# EAGLE design Kiwi_Rev_3.1S (EAGLE 9.1.0)
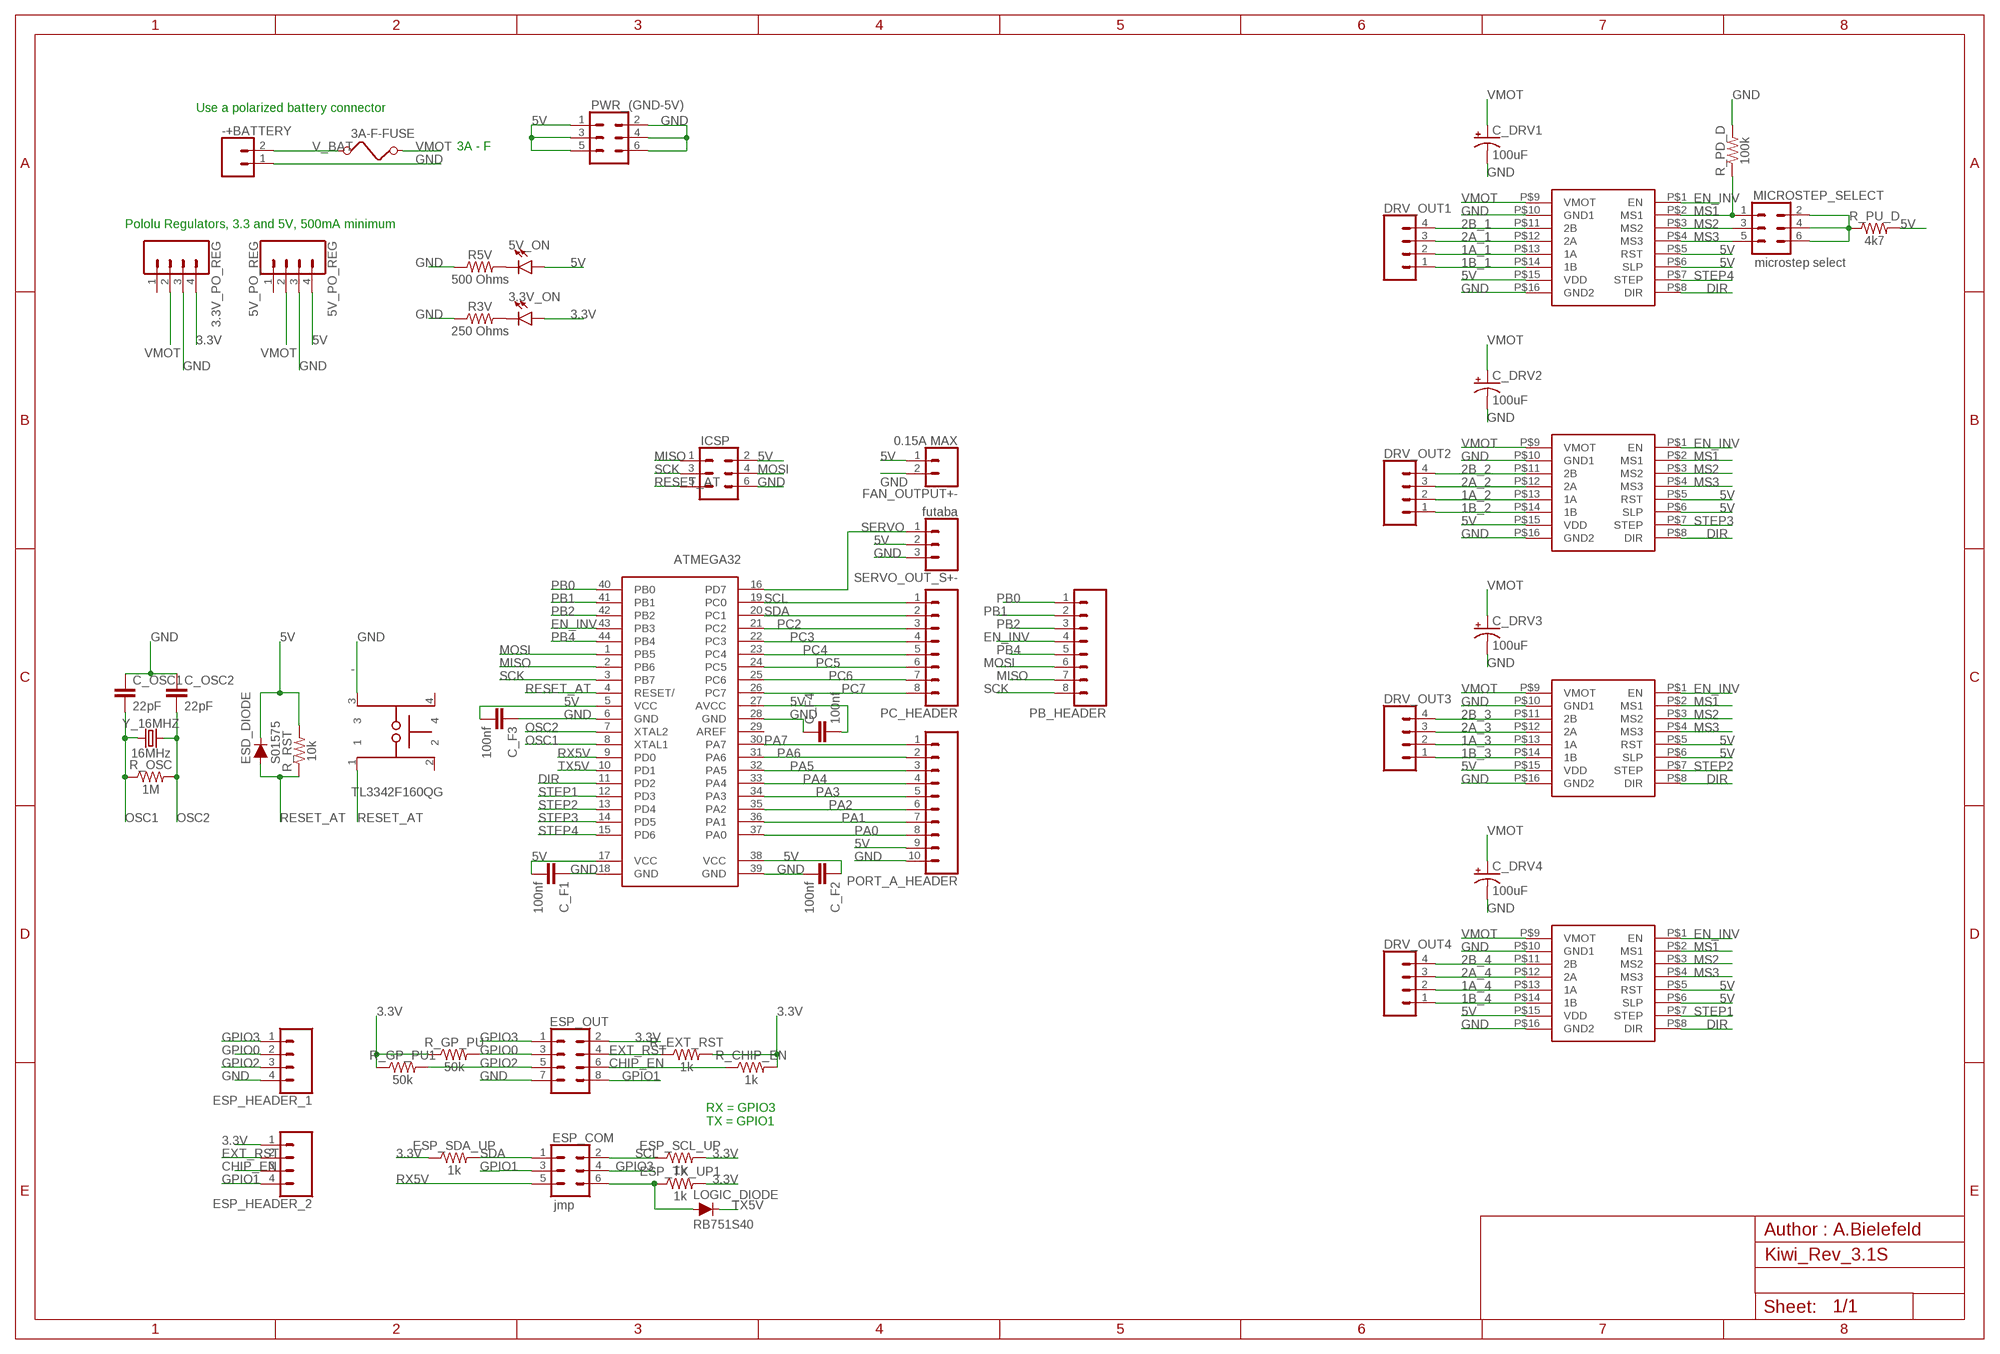
[diagram p0: schematic, sheet 1]

## Parts
3.3V_ON  LED1206  [LED-1206]
3.3V_PO_REG  CONN_04  [1X04]
3A-F-FUSE  FUSE  [FUSE]
5V_ON  LED1206  [LED-1206]
5V_PO_REG  5V_PO_REG  CONN_04  [1X04]
-  TL3342F160QG  [SW_TL3342F160QG]
-+BATTERY  CONN_023.5MM  [SCREWTERMINAL-3.5MM-2]
ATMEGA32  ATMEGA32  [QFP80P1200X1200X120-44N]
C_DRV1  100uF  100UF-POLAR-RADIAL-2.5MM-25V-20%  [CPOL-RADIAL-2.5MM-6.5MM]
C_DRV2  100uF  100UF-POLAR-RADIAL-2.5MM-25V-20%  [CPOL-RADIAL-2.5MM-6.5MM]
C_DRV3  100uF  100UF-POLAR-RADIAL-2.5MM-25V-20%  [CPOL-RADIAL-2.5MM-6.5MM]
C_DRV4  100uF  100UF-POLAR-RADIAL-2.5MM-25V-20%  [CPOL-RADIAL-2.5MM-6.5MM]
C_F1  100nf  2.2UF-0603-10V-20%  [0603]
C_F2  100nf  2.2UF-0603-10V-20%  [0603]
C_F3  100nf  2.2UF-0603-10V-20%  [0603]
C_F4  100nf  2.2UF-0603-10V-20%  [0603]
C_OSC1  22pF  2.2UF-1206-50V-10%  [1206]
C_OSC2  22pF  2.2UF-1206-50V-10%  [1206]
DRIVER1  POLOLU_A4988  [POLOLU_CARRIER]
DRIVER2  POLOLU_A4988  [POLOLU_CARRIER]
DRIVER3  POLOLU_A4988  [POLOLU_CARRIER]
DRIVER4  POLOLU_A4988  [POLOLU_CARRIER]
DRV_OUT1  CONN_04  [1X04]
DRV_OUT2  CONN_04  [1X04]
DRV_OUT3  CONN_04  [1X04]
DRV_OUT4  CONN_04  [1X04]
ESD_DIODE  S01575  [1206]
ESP_COM  jmp  CONN_03X2FEMALE  [2X3]
ESP_HEADER_1  CONN_04  [1X04]
ESP_HEADER_2  CONN_04  [1X04]
ESP_OUT  CONN_04X2  [2X4]
ESP_SCL_UP  1k  10OHM-1206-1/4W-1%  [1206]
ESP_SDA_UP  1k  10OHM-1206-1/4W-1%  [1206]
ESP_TX_UP1  1k  10OHM-1206-1/4W-1%  [1206]
FAN_OUTPUT+-  0.15A MAX  CONN_02  [1X02]
ICSP  CONN_03X22X3_SILK_MALE_PTH  [2X3]
LOGIC_DIODE  RB751S40  [SOD523]
MICROSTEP_SELECT  microstep select  CONN_03X2FEMALE  [2X3]
PB_HEADER  CONN_08"  [1X08]
PC_HEADER  CONN_08"  [1X08]
PORT_A_HEADER  CONN_10"  [1X10]
PWR_(GND-5V)  CONN_03X22X3_SILK_MALE_PTH  [2X3]
R3V  250 Ohms  10OHM-1206-1/4W-1%  [1206]
R5V  500 Ohms  10OHM-1206-1/4W-1%  [1206]
R_CHIP_EN  1k  10OHM-1206-1/4W-1%  [1206]
R_EXT_RST  1k  10OHM-1206-1/4W-1%  [1206]
R_GP_PU  50k  10OHM-1206-1/4W-1%  [1206]
R_GP_PU1  50k  10OHM-1206-1/4W-1%  [1206]
R_OSC  1M  10OHM-1206-1/4W-1%  [1206]
R_PD_D  100k  10OHM-1206-1/4W-1%  [1206]
R_PU_D  4k7  10OHM-1206-1/4W-1%  [1206]
R_RST  10k  10OHM-1206-1/4W-1%  [1206]
SERVO_OUT_S+-  futaba  CONN_03  [1X03]
Y_16MHZ  16MHz  CRYSTAL-16MHZPTH-HC49US  [HC49US]

## Nets
1A_1: DRIVER1.P$13(1A) DRV_OUT1.2
1A_2: DRIVER2.P$13(1A) DRV_OUT2.2
1A_3: DRIVER3.P$13(1A) DRV_OUT3.2
1A_4: DRIVER4.P$13(1A) DRV_OUT4.2
1B_1: DRIVER1.P$14(1B) DRV_OUT1.1
1B_2: DRIVER2.P$14(1B) DRV_OUT2.1
1B_3: DRIVER3.P$14(1B) DRV_OUT3.1
1B_4: DRIVER4.P$14(1B) DRV_OUT4.1
2A_1: DRIVER1.P$12(2A) DRV_OUT1.3
2A_2: DRIVER2.P$12(2A) DRV_OUT2.3
2A_3: DRIVER3.P$12(2A) DRV_OUT3.3
2A_4: DRIVER4.P$12(2A) DRV_OUT4.3
2B_1: DRIVER1.P$11(2B) DRV_OUT1.4
2B_2: DRIVER2.P$11(2B) DRV_OUT2.4
2B_3: DRIVER3.P$11(2B) DRV_OUT3.4
2B_4: DRIVER4.P$11(2B) DRV_OUT4.4
3.3V: 3.3V_ON.A 3.3V_PO_REG.4 ESP_HEADER_2.1 ESP_OUT.2 ESP_SCL_UP.2 ESP_SDA_UP.1 ESP_TX_UP1.2 R_CHIP_EN.2 R_EXT_RST.2 R_GP_PU1.1 R_GP_PU.1
5V: 5V_ON.A 5V_PO_REG.4 ATMEGA32.5(VCC) ATMEGA32.17(VCC) ATMEGA32.27(AVCC) ATMEGA32.38(VCC) C_F1.2 C_F2.1 C_F3.2 C_F4.2 DRIVER1.P$5(RST) DRIVER1.P$6(SLP) DRIVER1.P$15(VDD) DRIVER2.P$5(RST) DRIVER2.P$6(SLP) DRIVER2.P$15(VDD) DRIVER3.P$5(RST) DRIVER3.P$6(SLP) DRIVER3.P$15(VDD) DRIVER4.P$5(RST) DRIVER4.P$6(SLP) DRIVER4.P$15(VDD) ESD_DIODE.2(C) FAN_OUTPUT+-.1 ICSP.2 PORT_A_HEADER.9 PWR_(GND-5V).1 PWR_(GND-5V).3 PWR_(GND-5V).5 R_PU_D.2 R_RST.2 SERVO_OUT_S+-.2
CHIP_EN: ESP_HEADER_2.3 ESP_OUT.6 R_CHIP_EN.1
DIR: ATMEGA32.11(PD2) DRIVER1.P$8(DIR) DRIVER2.P$8(DIR) DRIVER3.P$8(DIR) DRIVER4.P$8(DIR)
EN_INV: ATMEGA32.43(PB3) DRIVER1.P$1(EN) DRIVER2.P$1(EN) DRIVER3.P$1(EN) DRIVER4.P$1(EN) PB_HEADER.4
EXT_RST: ESP_HEADER_2.2 ESP_OUT.4 R_EXT_RST.1
GND: 3.3V_PO_REG.3 5V_PO_REG.3 -+BATTERY.1 -.3 ATMEGA32.6(GND) ATMEGA32.18(GND) ATMEGA32.28(GND) ATMEGA32.39(GND) C_DRV1.2(-) C_DRV2.2(-) C_DRV3.2(-) C_DRV4.2(-) C_F1.1 C_F2.2 C_F3.1 C_F4.1 C_OSC1.1 C_OSC2.1 DRIVER1.P$10(GND1) DRIVER1.P$16(GND2) DRIVER2.P$10(GND1) DRIVER2.P$16(GND2) DRIVER3.P$10(GND1) DRIVER3.P$16(GND2) DRIVER4.P$10(GND1) DRIVER4.P$16(GND2) ESP_HEADER_1.4 ESP_OUT.7 FAN_OUTPUT+-.2 ICSP.6 PORT_A_HEADER.10 PWR_(GND-5V).2 PWR_(GND-5V).4 PWR_(GND-5V).6 R3V.1 R5V.1 R_PD_D.2 SERVO_OUT_S+-.3
GPIO0: ESP_HEADER_1.2 ESP_OUT.3 R_GP_PU.2
GPIO1: ESP_COM.3 ESP_HEADER_2.4 ESP_OUT.8
GPIO2: ESP_HEADER_1.3 ESP_OUT.5 R_GP_PU1.2
GPIO3: ESP_COM.4 ESP_HEADER_1.1 ESP_OUT.1
MISO: ATMEGA32.2(PB6) ICSP.1 PB_HEADER.7
MOSI: ATMEGA32.1(PB5) ICSP.4 PB_HEADER.6
MS1: DRIVER1.P$2(MS1) DRIVER2.P$2(MS1) DRIVER3.P$2(MS1) DRIVER4.P$2(MS1) MICROSTEP_SELECT.1 R_PD_D.1
MS2: DRIVER1.P$3(MS2) DRIVER2.P$3(MS2) DRIVER3.P$3(MS2) DRIVER4.P$3(MS2) MICROSTEP_SELECT.3
MS3: DRIVER1.P$4(MS3) DRIVER2.P$4(MS3) DRIVER3.P$4(MS3) DRIVER4.P$4(MS3) MICROSTEP_SELECT.5
N$1: 3.3V_ON.C R3V.2
N$2: 5V_ON.C R5V.2
N$18: ESP_COM.6 ESP_TX_UP1.1 LOGIC_DIODE.A
NET_PU1: MICROSTEP_SELECT.2 MICROSTEP_SELECT.4 MICROSTEP_SELECT.6 R_PU_D.1
OSC1: ATMEGA32.8(XTAL1) C_OSC1.2 R_OSC.1 Y_16MHZ.1
OSC2: ATMEGA32.7(XTAL2) C_OSC2.2 R_OSC.2 Y_16MHZ.2
PA0: ATMEGA32.37(PA0) PORT_A_HEADER.8
PA1: ATMEGA32.36(PA1) PORT_A_HEADER.7
PA2: ATMEGA32.35(PA2) PORT_A_HEADER.6
PA3: ATMEGA32.34(PA3) PORT_A_HEADER.5
PA4: ATMEGA32.33(PA4) PORT_A_HEADER.4
PA5: ATMEGA32.32(PA5) PORT_A_HEADER.3
PA6: ATMEGA32.31(PA6) PORT_A_HEADER.2
PA7: ATMEGA32.30(PA7) PORT_A_HEADER.1
PB0: ATMEGA32.40(PB0) PB_HEADER.1
PB1: ATMEGA32.41(PB1) PB_HEADER.2
PB2: ATMEGA32.42(PB2) PB_HEADER.3
PB4: ATMEGA32.44(PB4) PB_HEADER.5
PC2: ATMEGA32.21(PC2) PC_HEADER.3
PC3: ATMEGA32.22(PC3) PC_HEADER.4
PC4: ATMEGA32.23(PC4) PC_HEADER.5
PC5: ATMEGA32.24(PC5) PC_HEADER.6
PC6: ATMEGA32.25(PC6) PC_HEADER.7
PC7: ATMEGA32.26(PC7) PC_HEADER.8
RESET_AT: -.1 ATMEGA32.4(RESET/) ESD_DIODE.1(A) ICSP.5 R_RST.1
RX5V: ATMEGA32.9(PD0) ESP_COM.5
SCK: ATMEGA32.3(PB7) ICSP.3 PB_HEADER.8
SCL: ATMEGA32.19(PC0) ESP_COM.2 ESP_SCL_UP.1 PC_HEADER.1
SDA: ATMEGA32.20(PC1) ESP_COM.1 ESP_SDA_UP.2 PC_HEADER.2
SERVO: ATMEGA32.16(PD7) SERVO_OUT_S+-.1
STEP1: ATMEGA32.12(PD3) DRIVER4.P$7(STEP)
STEP2: ATMEGA32.13(PD4) DRIVER3.P$7(STEP)
STEP3: ATMEGA32.14(PD5) DRIVER2.P$7(STEP)
STEP4: ATMEGA32.15(PD6) DRIVER1.P$7(STEP)
TX5V: ATMEGA32.10(PD1) LOGIC_DIODE.C
V_BAT: 3A-F-FUSE.1 -+BATTERY.2
VMOT: 3.3V_PO_REG.2 3A-F-FUSE.2 5V_PO_REG.2 C_DRV1.1(+) C_DRV2.1(+) C_DRV3.1(+) C_DRV4.1(+) DRIVER1.P$9(VMOT) DRIVER2.P$9(VMOT) DRIVER3.P$9(VMOT) DRIVER4.P$9(VMOT)
Unconnected: 3.3V_PO_REG.1 5V_PO_REG.1 -.2 -.4 ATMEGA32.29(AREF)

## Notes on the sheet
- Use a polarized battery connector
- 3A - F
- Pololu Regulators, 3.3 and 5V, 500mA minimum
- RX = GPIO3
  TX = GPIO1
- Author : A.Bielefeld

## Library data of the parts
3.3V_ON 5V_ON = SparkFun-LED:LED: LED (Generic) Standard schematic elements and footprints for 5mm, 3mm, 1206, and 0603 sized LEDs. Generic LEDs with no color specified.
3.3V_PO_REG 5V_PO_REG DRV_OUT1-DRV_OUT4 ESP_HEADER_1 ESP_HEADER_2 = SparkFun-Connectors:CONN_04: Multi connection point. Often used as Generic Header-pin footprint for 0.1 inch spaced/style header connections On any of the 0.1 inch spaced packages, you can populate with these: Break Away Headers - Straight (PRT-00116) Break Away Male Headers - Right Angle (PRT-00553) Female Headers (PRT-00115) Break Away Headers - Machine Pin (PRT-00117) Break Away Female Headers - Swiss Machine Pin (PRT-00743) For SCREWTERMINALS and SPRING TERMINALS visit here: Screw Terimnals on SparkFun.com (5mm/3.5mm/2.54mm spacing) This device is also useful as a general connection point to wire up your design to another part of your project. Our various solder wires solder well into these plated through hole pads. Hook-Up Wire - Assortment (Stranded, 22 AWG) (PRT-11375) Hook-Up Wire - Assortment (Solid Core, 22 AWG) (PRT-11367) View the entire wire category on our website here Special notes: Molex polarized connector foot print use with SKU : PRT-08231 with associated crimp pins and housings. 1MM SMD Version SKU: PRT-10208; PROD_ID: CONN-09696
3A-F-FUSE = special:FUSE: FUSE 5 x 20 mm
- = TL3342F160QG:TL3342F160QG: TL3342 Series SPST 1.6 N Round Button Gull Wing Surface Mount Tactile Switch; AVAILABILITY: Good; DESCRIPTION: TL3342 Series SPST 1.6 N Round Button Gull Wing Surface Mount Tactile Switch; MF: E-Switch; MP: TL3342F160QG; PACKAGE: None; PRICE: 0.41 USD
-+BATTERY = SparkFun-Connectors:CONN_02: Multi connection point. Often used as Generic Header-pin footprint for 0.1 inch spaced/style header connections On any of the 0.1 inch spaced packages, you can populate with these: Break Away Headers - Straight (PRT-00116) Break Away Male Headers - Right Angle (PRT-00553) Female Headers (PRT-00115) Break Away Headers - Machine Pin (PRT-00117) Break Away Female Headers - Swiss Machine Pin (PRT-00743) For SCREWTERMINALS and SPRING TERMINALS visit here: Screw Terimnals on SparkFun.com (5mm/3.5mm/2.54mm spacing) This device is also useful as a general connection point to wire up your design to another part of your project. Our various solder wires solder well into these plated through hole pads. Hook-Up Wire - Assortment (Stranded, 22 AWG) (PRT-11375) Hook-Up Wire - Assortment (Solid Core, 22 AWG) (PRT-11367) View the entire wire category on our website here Special notes: Molex polarized connector foot print use with: PRT-08233 with associated crimp pins and housings. 2.54_SCREWTERM for use with PRT-10571. 3.5mm Screw Terminal footprints for PRT-08084 5mm Screw Terminal footprints for use with PRT-08432; PROD_ID: CONN-08399
ATMEGA32 = ATMEGA32:ATMEGA32
C_DRV1-C_DRV4 = SparkFun-Capacitors:100UF-POLAR: 100µF polarized capacitors A capacitor is a passive two-terminal electrical component used to store electrical energy temporarily in an electric field.; PROD_ID: CAP-08439
C_F1-C_F4 = SparkFun-Capacitors:2.2UF: 2.2µF ceramic capacitors A capacitor is a passive two-terminal electrical component used to store electrical energy temporarily in an electric field.; PROD_ID: CAP-07888; VALUE: 2.2uF
C_OSC1 C_OSC2 = SparkFun-Capacitors:2.2UF: 2.2µF ceramic capacitors A capacitor is a passive two-terminal electrical component used to store electrical energy temporarily in an electric field.; PROD_ID: CAP-10009; VALUE: 2.2uF
DRIVER1-DRIVER4 = reprap:POLOLU_A4988
ESD_DIODE = SparkFun-DiscreteSemi:S01575
ESP_COM MICROSTEP_SELECT = SparkFun-Connectors:CONN_03X2: Multi connection point. Often used as Generic Header-pin footprint for 0.1 inch spaced/style header connections You can populate with any combo of single row headers, but if you'd like an exact match, check these: Header - 2x3 (Male, 0.1") (PRT-12807) Header - 2x3 (Female, 0.1") (PRT-13010) 2x3 Pin Shrouded Header (PRT-10877) On any of the 0.1 inch spaced packages, you can populate with these: Break Away Headers - Straight (PRT-00116) Break Away Male Headers - Right Angle (PRT-00553) Female Headers (PRT-00115) Break Away Headers - Machine Pin (PRT-00117) Break Away Female Headers - Swiss Machine Pin (PRT-00743) Special note: the shrouded connector mates well with our 3x2 ribbon cables: Ribbon Crimp Connector - 6-pin (2x3, Female) (PRT-10651) Ribbon Cable - 6 wire (15ft) (PRT-10646); PROD_ID: CONN-11566; VALUE: FEMALE 2x3
ESP_OUT = SparkFun-Connectors:CONN_04X2: Multi connection point. Often used as Generic Header-pin footprint for 0.1 inch spaced/style header connections On any of the 0.1 inch spaced packages, you can populate with these: Break Away Headers - Straight (PRT-00116) Break Away Male Headers - Right Angle (PRT-00553) Female Headers (PRT-00115) Break Away Headers - Machine Pin (PRT-00117) Break Away Female Headers - Swiss Machine Pin (PRT-00743)
ESP_SCL_UP ESP_SDA_UP ESP_TX_UP1 R3V R5V R_CHIP_EN R_EXT_RST R_GP_PU R_GP_PU1 R_OSC R_PD_D R_PU_D R_RST = SparkFun-Resistors:10OHM: 10Ω resistor A resistor is a passive two-terminal electrical component that implements electrical resistance as a circuit element. Resistors act to reduce current flow, and, at the same time, act to lower voltage levels within circuits. - Wikipedia; PROD_ID: RES-08705; VALUE: 10
FAN_OUTPUT+- = SparkFun-Connectors:CONN_02: Multi connection point. Often used as Generic Header-pin footprint for 0.1 inch spaced/style header connections On any of the 0.1 inch spaced packages, you can populate with these: Break Away Headers - Straight (PRT-00116) Break Away Male Headers - Right Angle (PRT-00553) Female Headers (PRT-00115) Break Away Headers - Machine Pin (PRT-00117) Break Away Female Headers - Swiss Machine Pin (PRT-00743) For SCREWTERMINALS and SPRING TERMINALS visit here: Screw Terimnals on SparkFun.com (5mm/3.5mm/2.54mm spacing) This device is also useful as a general connection point to wire up your design to another part of your project. Our various solder wires solder well into these plated through hole pads. Hook-Up Wire - Assortment (Stranded, 22 AWG) (PRT-11375) Hook-Up Wire - Assortment (Solid Core, 22 AWG) (PRT-11367) View the entire wire category on our website here Special notes: Molex polarized connector foot print use with: PRT-08233 with associated crimp pins and housings. 2.54_SCREWTERM for use with PRT-10571. 3.5mm Screw Terminal footprints for PRT-08084 5mm Screw Terminal footprints for use with PRT-08432
ICSP PWR_(GND-5V) = SparkFun-Connectors:CONN_03X2: Multi connection point. Often used as Generic Header-pin footprint for 0.1 inch spaced/style header connections You can populate with any combo of single row headers, but if you'd like an exact match, check these: Header - 2x3 (Male, 0.1") (PRT-12807) Header - 2x3 (Female, 0.1") (PRT-13010) 2x3 Pin Shrouded Header (PRT-10877) On any of the 0.1 inch spaced packages, you can populate with these: Break Away Headers - Straight (PRT-00116) Break Away Male Headers - Right Angle (PRT-00553) Female Headers (PRT-00115) Break Away Headers - Machine Pin (PRT-00117) Break Away Female Headers - Swiss Machine Pin (PRT-00743) Special note: the shrouded connector mates well with our 3x2 ribbon cables: Ribbon Crimp Connector - 6-pin (2x3, Female) (PRT-10651) Ribbon Cable - 6 wire (15ft) (PRT-10646); PROD_ID: CONN-09701
LOGIC_DIODE = SparkFun-DiscreteSemi:RB751S40
PB_HEADER PC_HEADER = SparkFun-Connectors:CONN_08: Multi connection point. Often used as Generic Header-pin footprint for 0.1 inch spaced/style header connections On any of the 0.1 inch spaced packages, you can populate with these: Break Away Headers - Straight (PRT-00116) Break Away Male Headers - Right Angle (PRT-00553) Female Headers (PRT-00115) Break Away Headers - Machine Pin (PRT-00117) Break Away Female Headers - Swiss Machine Pin (PRT-00743) Arduino Stackable Header - 8 Pin (PRT-09279) For SCREWTERMINALS and SPRING TERMINALS visit here: Screw Terimnals on SparkFun.com (5mm/3.5mm/2.54mm spacing) This device is also useful as a general connection point to wire up your design to another part of your project. Our various solder wires solder well into these plated through hole pads. Hook-Up Wire - Assortment (Stranded, 22 AWG) (PRT-11375) Hook-Up Wire - Assortment (Solid Core, 22 AWG) (PRT-11367) View the entire wire category on our website here Special notes: Molex polarized connector foot print use with SKU : PRT-08231 with associated crimp pins and housings. 1MM SMD Version SKU: PRT-10208 NOTES ON THE VARIANTS LOCK and LOCK_LONGPADS... This footprint was designed to help hold the alignment of a through-hole component (i.e. 6-pin header) while soldering it into place. You may notice that each hole has been shifted either up or down by 0.005 of an inch from it's more standard position (which is a perfectly straight line). This slight alteration caused the pins (the squares in the middle) to touch the edges of the holes. Because they are alternating, it causes a "brace" to hold the component in place. 0.005 has proven to be the perfect amount of "off-center" position when using our standard breakaway headers. Although looks a little odd when you look at the bare footprint, once you have a header in there, the alteration is very hard to notice. Also,if you push a header all the way into place, it is covered up entirely on the bottom side.; PROD_ID: CONN-08438
PORT_A_HEADER = SparkFun-Connectors:CONN_10: Multi connection point. Often used as Generic Header-pin footprint for 0.1 inch spaced/style header connections On any of the 0.1 inch spaced packages, you can populate with these: Break Away Headers - Straight (PRT-00116) Break Away Male Headers - Right Angle (PRT-00553) Female Headers (PRT-00115) Break Away Headers - Machine Pin (PRT-00117) Break Away Female Headers - Swiss Machine Pin (PRT-00743) Arduino Stackable Header - 10 Pin (PRT-11376) For SCREWTERMINALS and SPRING TERMINALS visit here: Screw Terimnals on SparkFun.com (5mm/3.5mm/2.54mm spacing) This device is also useful as a general connection point to wire up your design to another part of your project. Our various solder wires solder well into these plated through hole pads. Hook-Up Wire - Assortment (Stranded, 22 AWG) (PRT-11375) Hook-Up Wire - Assortment (Solid Core, 22 AWG) (PRT-11367) View the entire wire category on our website here Special notes: Molex polarized connector foot print use with SKU : PRT-08231 with associated crimp pins and housings. 1MM SMD Version SKU: PRT-10208 NOTES ON THE VARIANTS LOCK and LOCK_LONGPADS... This footprint was designed to help hold the alignment of a through-hole component (i.e. 6-pin header) while soldering it into place. You may notice that each hole has been shifted either up or down by 0.005 of an inch from it's more standard position (which is a perfectly straight line). This slight alteration caused the pins (the squares in the middle) to touch the edges of the holes. Because they are alternating, it causes a "brace" to hold the component in place. 0.005 has proven to be the perfect amount of "off-center" position when using our standard breakaway headers. Although looks a little odd when you look at the bare footprint, once you have a header in there, the alteration is very hard to notice. Also,if you push a header all the way into place, it is covered up entirely on the bottom side.; PROD_ID: CONN-11563
SERVO_OUT_S+- = SparkFun-Connectors:CONN_03: Multi connection point. Often used as Generic Header-pin footprint for 0.1 inch spaced/style header connections On any of the 0.1 inch spaced packages, you can populate with these: Break Away Headers - Straight (PRT-00116) Break Away Male Headers - Right Angle (PRT-00553) Female Headers (PRT-00115) Break Away Headers - Machine Pin (PRT-00117) Break Away Female Headers - Swiss Machine Pin (PRT-00743) Stackable Header - 3 Pin (Female, 0.1") (PRT-13875) For SCREWTERMINALS and SPRING TERMINALS visit here: Screw Terimnals on SparkFun.com (5mm/3.5mm/2.54mm spacing) This device is also useful as a general connection point to wire up your design to another part of your project. Our various solder wires solder well into these plated through hole pads. Hook-Up Wire - Assortment (Stranded, 22 AWG) (PRT-11375) Hook-Up Wire - Assortment (Solid Core, 22 AWG) (PRT-11367) View the entire wire category on our website here Special notes: Molex polarized connector foot print use with SKU : PRT-08232 with associated crimp pins and housings.; PROD_ID: XXX-00000; VALUE: 455-1750-1-ND
Y_16MHZ = SparkFun-Clocks:CRYSTAL-16MHZ: 16MHz Crystal Digikey Example <http://www.digikey.com/product-search/en?keywords=535-9122-1-ND> Frequency: 16MHz Frequency Stability: ±50ppm Frequency Tolerance: ±20ppm Load Capacitance: 18pF SparkFun Products: Pro Micro -5V/16MHz <https://www.sparkfun.com/products/12640> SparkFun Serial Enabled LCD Kit <https://www.sparkfun.com/products/10097>; PROD_ID: XTAL-08181; SF_ID: COM-00536

## Board
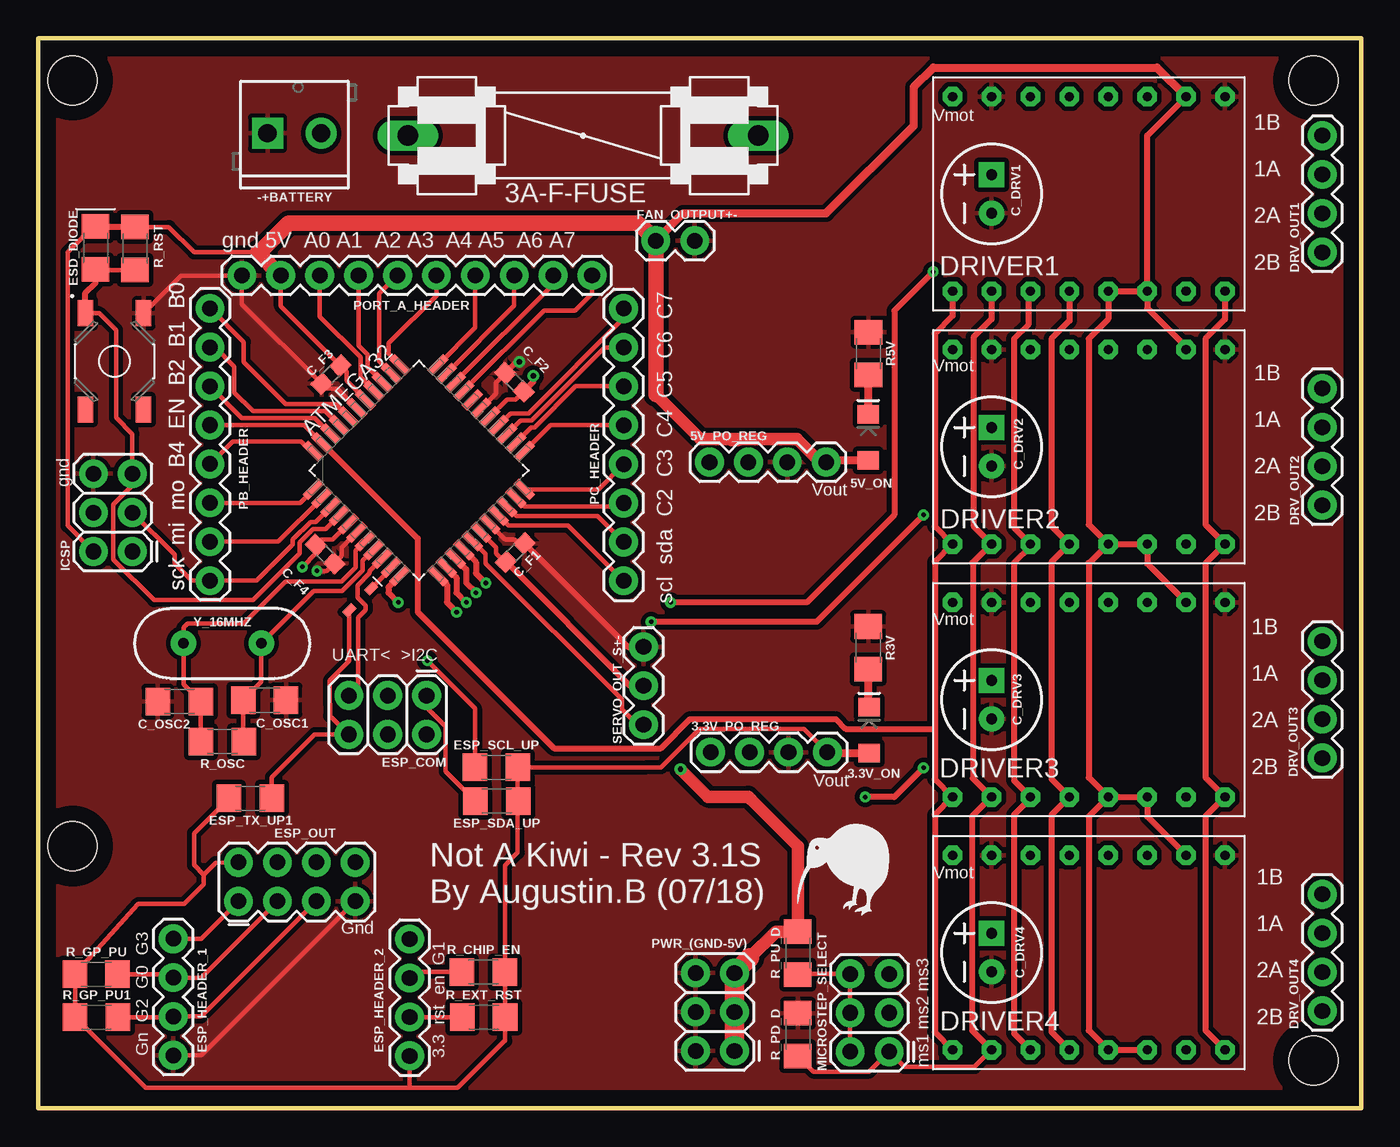
[diagram p1: board, top side]
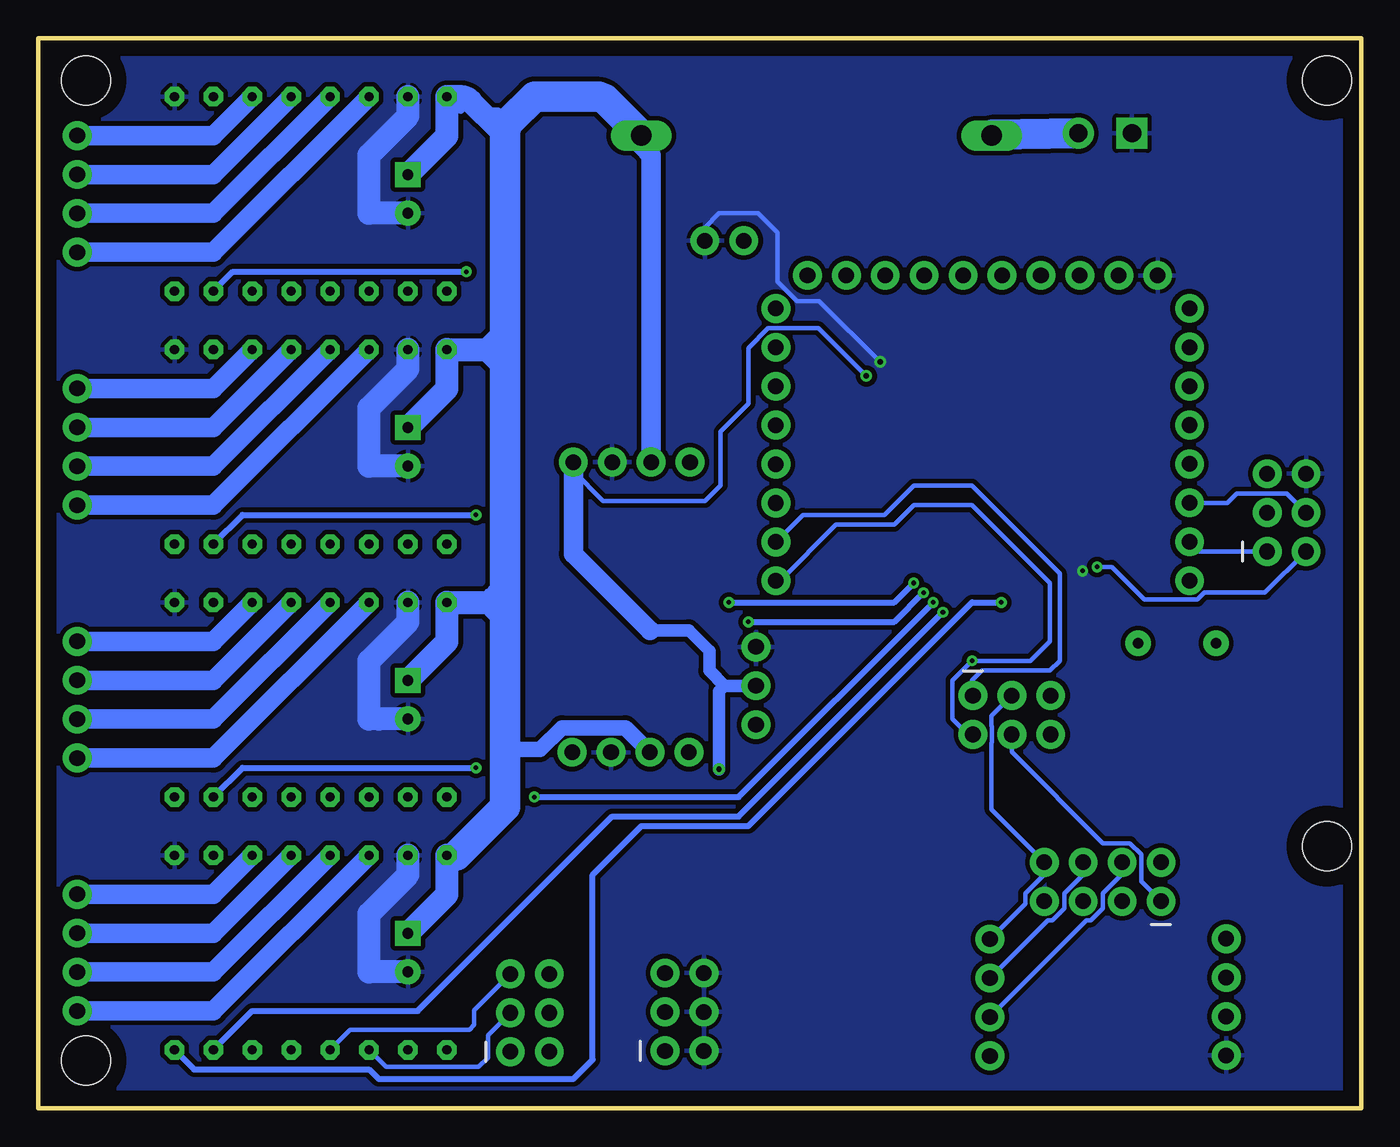
[diagram p2: board, bottom side, seen from below]

Size 86.36 x 69.85 mm. Coordinates in mm from the lower left corner, seen from the top.
Outline: 86.36,69.85 86.36,0 0,0 0,69.85 86.36,69.85
Copper layers (1*16): Top 0.035mm / dielectric 1.5mm / Bottom 0.035mm
Design rules "default": minimum track width 6mil, minimum drill 0.35mm, track to track 6mil, track to pad 6mil, pad to pad 6mil, via to via 6mil, smd to smd 6mil, copper to edge 40mil, drill to drill 6mil, minimum pad ring 10mil, minimum via ring 8mil, stop-mask expansion 4mil, vias tented up to drill 0mil, thermal gap 10mil
Holes 3.2 mm at 2.24,67.11 83.24,67.11 83.24,3.11 2.24,17.11

### Footprints (pad centres in the part's own frame; a part is rotated, then mirrored left to right if it is on the bottom)
LED-1206 = smd 1.2 x 1.4: A -1.5,0; C 1.5,0
1X04 = drill 1.016 pad 1.88: 1 0,0; 2 2.54,0; 3 5.08,0; 4 7.62,0
FUSE = drill 1.321 long: 1 -11.43,0; 2 11.43,0
SW_TL3342F160QG = smd 1.7 x 1: 1 -3.15,-1.9; 2 3.15,-1.9; 3 -3.15,1.9; 4 3.15,1.9
SCREWTERMINAL-3.5MM-2 = drill 1.2 pad 2.032 square: 1 0,0 | drill 1.2 pad 2.032: 2 3.5,0
QFP80P1200X1200X120-44N = smd 1.473 x 0.508: 1 -5.74,3.988; 2 -5.74,3.2; 3 -5.74,2.388; 4 -5.74,1.6; 5 -5.74,0.787; 6 -5.74,0; 7 -5.74,-0.787; 8 -5.74,-1.6; 9 -5.74,-2.388; 10 -5.74,-3.2; 11 -5.74,-3.988; 23 5.74,-3.988; 24 5.74,-3.2; 25 5.74,-2.388; 26 5.74,-1.6; 27 5.74,-0.787; 28 5.74,0; 29 5.74,0.787; 30 5.74,1.6; 31 5.74,2.388; 32 5.74,3.2; 33 5.74,3.988 | smd 0.508 x 1.473: 12 -3.988,-5.74; 13 -3.2,-5.74; 14 -2.388,-5.74; 15 -1.6,-5.74; 16 -0.787,-5.74; 17 0,-5.74; 18 0.787,-5.74; 19 1.6,-5.74; 20 2.388,-5.74; 21 3.2,-5.74; 22 3.988,-5.74; 34 3.988,5.74; 35 3.2,5.74; 36 2.388,5.74; 37 1.6,5.74; 38 0.787,5.74; 39 0,5.74; 40 -0.787,5.74; 41 -1.6,5.74; 42 -2.388,5.74; 43 -3.2,5.74; 44 -3.988,5.74
CPOL-RADIAL-2.5MM-6.5MM = drill 0.7 pad 1.651 square: 1 1.25,0 | drill 0.7 pad 1.651: 2 -1.25,0
0603 = smd 1.1 x 1: 1 -0.85,0; 2 0.85,0
1206 = smd 1.6 x 1.8: 1 -1.4,0; 2 1.4,0
POLOLU_CARRIER = drill 0.6 pad 1.27 octagon: P$1 -6.35,7.62; P$2 -6.35,5.08; P$3 -6.35,2.54; P$4 -6.35,0; P$5 -6.35,-2.54; P$6 -6.35,-5.08; P$7 -6.35,-7.62; P$8 -6.35,-10.16; P$9 6.35,7.62; P$10 6.35,5.08; P$11 6.35,2.54; P$12 6.35,0; P$13 6.35,-2.54; P$14 6.35,-5.08; P$15 6.35,-7.62; P$16 6.35,-10.16
1206' = smd 1.6 x 1.8: 1 -3.94,1.27; 2 -1.14,1.27
2X3 = drill 1.016 pad 1.88: 1 0,0; 2 0,2.54; 3 2.54,0; 4 2.54,2.54; 5 5.08,0; 6 5.08,2.54
2X4 = drill 1.016 pad 1.88: 1 -3.81,-1.27; 2 -3.81,1.27; 3 -1.27,-1.27; 4 -1.27,1.27; 5 1.27,-1.27; 6 1.27,1.27; 7 3.81,-1.27; 8 3.81,1.27
1X02 = drill 1.016 pad 1.88: 1 0,0; 2 2.54,0
SOD523 = smd 0.5 x 0.8: A 0,6; C 0,8
1X08 = drill 1.016 pad 1.88: 1 0,0; 2 2.54,0; 3 5.08,0; 4 7.62,0; 5 10.16,0; 6 12.7,0; 7 15.24,0; 8 17.78,0
1X10 = drill 1.016 pad 1.88: 1 0,0; 2 2.54,0; 3 5.08,0; 4 7.62,0; 5 10.16,0; 6 12.7,0; 7 15.24,0; 8 17.78,0; 9 20.32,0; 10 22.86,0
1X03 = drill 1.016 pad 1.88: 1 0,0; 2 2.54,0; 3 5.08,0
HC49US = drill 0.7 pad 1.651: 1 -2.54,0; 2 2.54,0

### Placement (x,y rotation side)
3.3V_ON  54.24,24.69 90 top
3.3V_PO_REG  43.89,23.24 0 top
3A-F-FUSE  35.56,63.5 0 top
5V_ON  54.18,43.8 90 top
5V_PO_REG  43.81,42.18 0 top
-  4.97,48.76 270 top
-+BATTERY  14.96,63.65 0 top
ATMEGA32  24.85,41.65 45 top
C_DRV1  62.23,59.69 90 top
C_DRV2  62.23,43.18 90 top
C_DRV3  62.23,26.67 90 top
C_DRV4  62.23,10.16 90 top
C_F1  31.13,36.28 225 top
C_F2  31.09,47.4 135 top
C_F3  19.11,47.89 44.2 top
C_F4  18.72,36.17 135 top
C_OSC1  14.78,26.64 180 top
C_OSC2  9.21,26.55 0 top
DRIVER1  67.31,59.69 90 top
DRIVER2  67.31,43.18 90 top
DRIVER3  67.31,26.67 90 top
DRIVER4  67.31,10.16 90 top
DRV_OUT1  83.82,63.5 270 top
DRV_OUT2  83.82,46.99 270 top
DRV_OUT3  83.82,30.48 270 top
DRV_OUT4  83.82,13.97 270 top
ESD_DIODE  S01575  [1206']  5.01,58.71 90 top
ESP_COM  25.35,26.94 180 top
ESP_HEADER_1  8.81,11.07 270 top
ESP_HEADER_2  24.24,3.42 90 top
ESP_OUT  16.88,14.78 0 top
ESP_SCL_UP  29.9,22.26 0 top
ESP_SDA_UP  29.93,20.05 180 top
ESP_TX_UP1  13.85,20.24 180 top
FAN_OUTPUT+-  40.31,56.64 0 top
ICSP  6.14,36.34 90 top
LOGIC_DIODE  16.06,28.27 315 top
MICROSTEP_SELECT  55.54,3.69 90 top
PB_HEADER  11.21,52.22 270 top
PC_HEADER  38.21,34.43 90 top
PORT_A_HEADER  36.15,54.37 180 top
PWR_(GND-5V)  45.45,3.74 90 top
R3V  54.18,30.05 270 top
R5V  54.19,49.26 270 top
R_CHIP_EN  29.06,8.9 0 top
R_EXT_RST  29.07,5.94 0 top
R_GP_PU  3.78,8.75 0 top
R_GP_PU1  3.8,5.94 0 top
R_OSC  12.03,23.93 180 top
R_PD_D  49.58,4.81 90 top
R_PU_D  49.58,10.13 90 top
R_RST  6.32,56.13 90 top
SERVO_OUT_S+-  39.51,25.04 90 top
Y_16MHZ  12.02,30.35 180 top

### Tracks (layer width: path | path; a pad name or v marks a point on that pad's centre or on a via)
1A_1
  Bottom 1.27: DRIVER1.P$13 74.93,60.96 DRV_OUT1.2
1A_2
  Bottom 1.27: DRIVER2.P$13 74.93,44.45 DRV_OUT2.2
1A_3
  Bottom 1.27: DRIVER3.P$13 74.93,27.94 DRV_OUT3.2
1A_4
  Bottom 1.27: DRIVER4.P$13 74.93,11.43 DRV_OUT4.2
1B_1
  Bottom 1.27: DRIVER1.P$14 74.93,63.5 DRV_OUT1.1
1B_2
  Bottom 1.27: DRIVER2.P$14 74.93,46.99 DRV_OUT2.1
1B_3
  Bottom 1.27: DRIVER3.P$14 74.93,30.48 DRV_OUT3.1
1B_4
  Bottom 1.27: DRIVER4.P$14 74.93,13.97 DRV_OUT4.1
2A_1
  Bottom 1.27: DRIVER1.P$12 74.93,58.42 DRV_OUT1.3
2A_2
  Bottom 1.27: DRIVER2.P$12 74.93,41.91 DRV_OUT2.3
2A_3
  Bottom 1.27: DRIVER3.P$12 74.93,25.4 DRV_OUT3.3
2A_4
  Bottom 1.27: DRIVER4.P$12 74.93,8.89 DRV_OUT4.3
2B_1
  Bottom 1.27: DRIVER1.P$11 74.93,55.88 DRV_OUT1.4
2B_2
  Bottom 1.27: DRIVER2.P$11 74.93,39.37 DRV_OUT2.4
2B_3
  Bottom 1.27: DRIVER3.P$11 74.93,22.86 DRV_OUT3.4
2B_4
  Bottom 1.27: DRIVER4.P$11 74.93,6.35 DRV_OUT4.4
3.3V
  Top 0.305: 3.3V_PO_REG.4 49.98,24.77 43.17,24.77 40.66,22.26 39.73,22.26 ESP_SCL_UP.2 31.3,20.08 | 31.3,20.08 ESP_SDA_UP.1 | 31.3,20.08 31.3,16.7 30.46,15.85 R_CHIP_EN.2 30.47,8.88 R_EXT_RST.2 30.48,4.4 30.44,4.4 27.36,1.32 24.13,1.32 | 10.79,15.24 10.79,14.61 9.53,13.34 6.52,13.34 R_GP_PU.1 2.4,8.97 R_GP_PU1.1 7.01,1.32 24.13,1.32 | 10.79,15.24 11.57,16.02 ESP_OUT.2 | 10.79,15.24 10.16,15.88 10.16,17.95 ESP_TX_UP1.2 | ESP_HEADER_2.1 24.24,1.43 24.13,1.32
  Top 0.508: 3.3V_PO_REG.4 51.56,23.19 3.3V_ON.A
5V  (via drill 0.3, 0.35)
  Top 0.305: ATMEGA32.38 20.12,47.49 20.12,48.09 C_F3.2 15.83,52.37 PORT_A_HEADER.9 | ATMEGA32.27 30.59,46.28 31.17,46.28 C_F2.1 | ATMEGA32.17 29.87,36.62 29.87,36.22 30.41,35.68 C_F1.2 | ATMEGA32.5 19.22,37.13 18.48,37.13 C_F4.2 | 4.22,57.53 3.78,57.53 | 3.78,57.53 ESD_DIODE.2 | C_F4.2 18.12,36.22 v17.24,35.34 | 49.58,11.63 R_PU_D.2 | R_RST.2 8.51,57.53 10.16,55.88 14.32,55.88 | ICSP.2 1.9,38.04 1.9,55.88 3.55,57.53 3.78,57.53 | 39.34,57.61 39.16,57.78 | C_F4.2 | 46.35,20.33 46.53,20.14
  Top 0.406: R_RST.2 4.22,57.53 | DRIVER2.P$5 68.58,38.1 68.58,50.24 69.85,51.51 DRIVER1.P$5 DRIVER1.P$6 | DRIVER2.P$5 68.63,35.61 68.58,35.61 68.58,21.59 DRIVER3.P$5 | DRIVER3.P$5 68.58,19.05 68.58,5.08 DRIVER4.P$5 DRIVER4.P$6 | DRIVER3.P$5 DRIVER3.P$6 72.39,19.05 DRIVER4.P$15 | DRIVER2.P$5 DRIVER2.P$6 72.39,35.56 DRIVER3.P$15 | DRIVER1.P$6 72.39,52.22 74.93,49.68 DRIVER2.P$15 | DRIVER1.P$6 72.39,63.5 DRIVER1.P$15 | C_F1.2 38.62,27.58 SERVO_OUT_S+-.2 | C_F2.1 32.31,47.41 v32.31,47.8
  Top 0.508: 5V_PO_REG.4 51.56,42.3 5V_ON.A | 40.51,56.83 42.09,58.42 51.44,58.42 57.15,64.14 57.15,66.67 58.42,67.94 73.02,67.94 DRIVER1.P$15
  Top 0.813: 5V_PO_REG.4 51.01,42.18 49.52,43.68 45.73,43.68 | 45.73,43.68 45.69,43.63 45.27,43.63 | 45.73,43.68 43.22,43.68 40.31,46.59 | v41.92,22.13 43.73,20.33 46.35,20.33 | 46.53,20.14 49.58,17.09 49.58,11.63 | 46.43,9.81 48.15,11.53 R_PU_D.2
  Top 1.016: FAN_OUTPUT+-.1 40.31,46.59 | FAN_OUTPUT+-.1 40.51,56.83 | FAN_OUTPUT+-.1 39.34,57.61 | 39.16,57.78 16.35,57.78 14.44,55.88 14.32,55.88 PORT_A_HEADER.9
  Top 1.27: 46.43,9.81 PWR_(GND-5V).5 PWR_(GND-5V).1 PWR_(GND-5V).3
  Bottom 0.305: v32.31,47.8 35.42,50.91 38.73,50.91 40.01,49.64 40.01,45.99 41.82,44.17 41.82,40.66 42.83,39.66 49.48,39.66 51.44,41.61 5V_PO_REG.4 | v17.24,35.34 16.29,35.34 14.15,33.2 10.69,33.2 10.23,33.66 6.29,33.66 ICSP.2
  Bottom 0.813: 46.43,31.19 43.89,31.19 42.55,29.84 42.55,28.58 41.55,27.58 | 41.55,27.58 SERVO_OUT_S+-.2 | 41.55,27.58 41.92,27.21 v41.92,22.13
  Bottom 1.27: 5V_PO_REG.4 51.44,36.2 46.43,31.19
CHIP_EN
  Top 0.305: R_CHIP_EN.1 24.64,8.9 ESP_HEADER_2.3
  Bottom 0.305: ESP_HEADER_2.3 20.47,12.27 20.17,12.27 19.39,13.05 19.39,14.03 18.15,15.27 ESP_OUT.6
DIR  (via drill 0.3)
  Top 0.406: DRIVER1.P$8 77.47,51.51 76.2,50.24 76.2,38.1 DRIVER2.P$8 76.2,35.56 76.2,21.59 DRIVER3.P$8 76.2,19.05 76.2,5.08 DRIVER4.P$8 | ATMEGA32.11 22.86,34.02 22.86,33.66 v23.5,33.02
  Bottom 0.406: DRIVER4.P$8 76.2,2.54 64.77,2.54 64.14,1.9 51.44,1.9 50.16,3.17 50.16,15.24 46.99,18.41 40.01,18.41 25.4,33.02 v23.5,33.02
EN_INV
  Top 0.305: ATMEGA32.43 17.36,44.6 PB_HEADER.4
  Top 0.406: DRIVER1.P$1 59.69,51.71 58.52,50.55 58.52,38 DRIVER2.P$1 58.52,35.66 58.52,24.77 | 58.52,24.77 58.52,21.49 DRIVER3.P$1 58.52,19.15 58.52,4.98 DRIVER4.P$1 | ATMEGA32.43 24.77,37.2 24.77,32.38 33.66,23.49 40.64,23.49 42.55,25.4 52.07,25.4 52.71,24.77 58.52,24.77
EXT_RST
  Top 0.305: R_EXT_RST.1 24.26,5.94 ESP_HEADER_2.2
  Bottom 0.305: ESP_HEADER_2.2 17.93,12.27 17.63,12.27 16.85,13.05 16.85,14.03 15.61,15.27 ESP_OUT.4
GND  (via drill 0.3, 0.35)
  Top 0.305: ATMEGA32.39 19.5,46.99 18.81,46.99 C_F3.1 13.29,52.51 PORT_A_HEADER.10 9.34,54.37 -.3 | ATMEGA32.28 29.87,46.67 29.87,47.38 C_F2.2 | ATMEGA32.18 29.47,38.14 30.48,37.13 31.09,37.13 31.35,36.88 C_F1.1 | ATMEGA32.6 19.81,36.61 19.81,36.06 C_F4.1 18.82,35.08 v18.19,35.08 | ESP_HEADER_1.4 10.62,3.45 ESP_OUT.7
  Top 0.406: C_F1.1 38.49,30.12 SERVO_OUT_S+-.3 | C_F2.2 31.21,48.72 v31.39,48.72
  Bottom 0.305: v31.39,48.72 35.38,52.7 36.83,52.7 38.1,53.98 38.1,57.15 39.37,58.42 41.91,58.42 42.85,57.48 FAN_OUTPUT+-.2
  Bottom 1.5: C_DRV1.2 62.25,58.42 64.77,58.42 64.77,62.23 62.23,64.77 DRIVER1.P$10 | C_DRV2.2 62.25,41.91 64.77,41.91 64.77,45.72 62.23,48.26 DRIVER2.P$10 | C_DRV3.2 64.11,25.42 64.14,25.4 64.77,25.4 64.77,29.21 62.23,31.75 DRIVER3.P$10 | C_DRV4.2 62.25,8.89 64.77,8.89 64.77,12.7 62.23,15.24 DRIVER4.P$10
  pour Bottom (isolate 0.305): 0,0 86.36,0 86.36,69.85 0,69.85
  pour Top (isolate 0.305): 86.36,0 0,0 0,69.85 86.36,69.85
GPIO0
  Top 0.305: R_GP_PU.2 8.59,8.75 ESP_HEADER_1.2 10.62,8.53 ESP_OUT.3
GPIO1
  Bottom 0.305: ESP_HEADER_2.4 21.93,13.34 21.93,14.03 20.69,15.27 ESP_OUT.8 24.13,19.49 24.13,23.86 24.11,23.89 24.11,24.92 24.13,24.94 24.13,25.62 ESP_COM.3
GPIO2
  Top 0.305: R_GP_PU1.2 8.77,5.94 ESP_HEADER_1.3 10.62,5.99 ESP_OUT.5
GPIO3
  Top 0.305: ESP_HEADER_1.1 10.62,11.07 ESP_OUT.1
  Bottom 0.305: ESP_COM.4 22.81,23.25 16.85,17.3 15.09,17.3 14.36,16.57 14.36,14.81 ESP_OUT.1
MISO
  Top 0.305: ATMEGA32.2 15.66,36.98 PB_HEADER.7
  Bottom 0.305: PB_HEADER.7 10.57,36.34 ICSP.1
MOSI
  Top 0.305: ATMEGA32.1 17.08,39.52 PB_HEADER.6 | ATMEGA32.1
  Bottom 0.305: PB_HEADER.6 8.74,39.52 8.13,40.13 4.84,40.13 ICSP.4
MS1
  Top 0.305: R_PD_D.1 50.6,2.39 54.24,2.39 MICROSTEP_SELECT.1 56.54,2.69 61.11,2.69 DRIVER4.P$2
  Top 0.406: DRIVER1.P$2 62.23,51.51 61.05,50.33 61.05,38.01 DRIVER2.P$2 61.01,35.61 | 61.01,35.61 60.96,35.61 | 61.01,35.61 61.01,21.54 DRIVER3.P$2 60.96,19.05 60.96,5.08 DRIVER4.P$2
MS2
  Top 0.406: DRIVER1.P$3 64.62,53.19 64.62,51.16 63.7,50.24 63.7,37.9 DRIVER2.P$3 64.77,36.68 63.7,35.61 63.7,21.39 DRIVER3.P$3 64.77,20.22 63.7,19.15 63.7,4.88 DRIVER4.P$3
  Bottom 0.305: MICROSTEP_SELECT.3 57,4.77 57,3.3 57.61,2.69 63.65,2.69 DRIVER4.P$3
MS3
  Top 0.406: DRIVER1.P$4 67.31,51.41 66.14,50.24 66.14,38 DRIVER2.P$4 66.14,35.66 66.14,21.49 DRIVER3.P$4 66.14,19.15 66.14,4.98 DRIVER4.P$4
  Bottom 0.305: MICROSTEP_SELECT.5 57.91,6.4 57.91,5.44 58.22,5.13 65.99,5.13 DRIVER4.P$4
N$1
  Top 0.508: 3.3V_ON.C 54.18,26.25 R3V.2
N$2
  Top 0.508: 5V_ON.C 54.19,45.31 R5V.2
N$18
  Top 0.305: LOGIC_DIODE.A 20.31,29.2 19.02,27.91 19.02,26.43 19.05,26.4 19.05,25.62 ESP_COM.6 18.05,24.4 15.25,21.6 ESP_TX_UP1.1
NET_PU1
  Top 0.305: R_PU_D.1 49.62,8.77 MICROSTEP_SELECT.6 MICROSTEP_SELECT.4 MICROSTEP_SELECT.2
OSC1
  Top 0.305: ATMEGA32.8 21.88,36.45 21.18,35.76 21.18,35.12 19.85,33.78 17.99,33.78 Y_16MHZ.1 14.56,27.82 C_OSC1.2 13.38,23.98 R_OSC.1
OSC2
  Top 0.305: ATMEGA32.7 20.73,36.41 20.73,35.31 19.81,34.39 16.15,34.39 13.41,31.65 9.75,31.65 9.48,31.37 Y_16MHZ.2 9.48,27.68 C_OSC2.2 10.61,23.95 R_OSC.2
PA0
  Top 0.305: ATMEGA32.37 21.03,47.72 21.03,49.02 18.37,51.68 PORT_A_HEADER.8
PA1
  Top 0.305: ATMEGA32.36 21.49,48.38 21.49,49.21 20.91,49.79 PORT_A_HEADER.7
PA2
  Top 0.305: ATMEGA32.35 22.25,48.77 22.25,53.17 PORT_A_HEADER.6
PA3
  Top 0.305: ATMEGA32.34 22.86,49.27 22.86,49.94 25.99,53.07 PORT_A_HEADER.5
PA4
  Top 0.305: ATMEGA32.33 28.53,50.97 PORT_A_HEADER.4
PA5
  Top 0.305: ATMEGA32.32 31.07,52.39 PORT_A_HEADER.3
PA6
  Top 0.305: ATMEGA32.31 33.61,53.78 PORT_A_HEADER.2
PA7
  Top 0.305: ATMEGA32.30 33.01,52.07 35.05,52.07 36.15,53.17 PORT_A_HEADER.1
PB0
  Top 0.305: ATMEGA32.40 19.4,45.97 16.15,45.97 13.41,48.72 13.41,50.02 PB_HEADER.1
PB1
  Top 0.305: ATMEGA32.41 18.71,45.52 14.02,45.52 12.8,46.74 12.8,48.41 11.53,49.68 PB_HEADER.2
PB2
  Top 0.305: ATMEGA32.42 18.05,45.06 13.29,45.06 PB_HEADER.3
PB4
  Top 0.305: PB_HEADER.5 12.68,43.54 17.14,43.54 17.55,43.13 17.73,43.13 18.31,42.55 | ATMEGA32.44 18.31,42.55 | 18.31,42.55 | 18.41,42.55 18.31,42.55
PC2
  Top 0.305: ATMEGA32.21 31.75,39.27 37.97,39.27 PC_HEADER.3
PC3
  Top 0.305: ATMEGA32.22 36.57,40.41 PC_HEADER.4
PC4
  Top 0.305: ATMEGA32.23 33.43,44.59 PC_HEADER.5
PC5
  Top 0.305: ATMEGA32.24 32.18,44.45 32.38,44.45 35.06,47.13 PC_HEADER.6
PC6
  Top 0.305: ATMEGA32.25 31.48,44.91 32.19,44.91 36.96,49.67 PC_HEADER.7
PC7
  Top 0.305: ATMEGA32.26 30.83,45.36 32,45.36 38.21,51.57 PC_HEADER.8
RESET_AT
  Top 0.305: ATMEGA32.4 18.76,37.82 17.96,37.82 17.07,36.93 17.07,36.22 14.02,33.17 10.79,33.17 10.67,33.17 7.55,33.17 4.89,35.83 4.89,39.4 6.14,40.64 ICSP.5 6.14,44.02 5.08,45.09 5.08,50.8 3.97,51.91 -.1 | ESD_DIODE.1 3.78,54.73 R_RST.1
  Top 0.406: ESD_DIODE.1 3.74,53.88 3.07,53.21 -.1
RX5V
  Top 0.305: ATMEGA32.9 21.64,35.06 21.64,34.93 20.86,34.14 20.86,33.35 21.38,32.82 21.38,32.53 20.88,32.03 20.88,27.55 ESP_COM.5
SCK
  Top 0.305: ATMEGA32.3 18.1,38.28 17.77,38.28 16.61,37.12 16.61,36.79 14.27,34.44 PB_HEADER.8 10.01,34.44 8.89,35.56 8.89,36.13 ICSP.3
SCL  (via drill 0.3)
  Top 0.305: ATMEGA32.19 30.7,38.05 34.59,38.05 PC_HEADER.1 | v25.4,29.21 28.5,26.11 ESP_SCL_UP.1
  Bottom 0.305: PC_HEADER.1 37.96,34.43 34.29,38.1 30.48,38.1 29.21,39.37 25.4,39.37 20.32,34.29 20.32,30.48 21.59,29.21 v25.4,29.21 26.67,27.94 26.67,25.4 25.67,24.4 ESP_COM.2
SDA
  Top 0.305: ATMEGA32.20 31.21,38.66 36.52,38.66 PC_HEADER.2 | ESP_COM.1 25.35,26.16 26.59,24.92 26.59,21.98 ESP_SDA_UP.2
  Bottom 0.305: PC_HEADER.2 36.45,38.73 31.12,38.73 29.21,40.64 25.4,40.64 19.69,34.92 19.69,29.21 20.32,28.58 24.77,28.58 25.4,27.94 25.4,26.99 ESP_COM.1
SERVO
  Top 0.305: ATMEGA32.16 29.21,36.17 29.21,35.56 38.1,26.67 38.1,26.03 39.09,25.04 SERVO_OUT_S+-.1
STEP1  (via drill 0.3)
  Top 0.406: ATMEGA32.12 26.67,34.18 26.67,33.02 v27.3,32.38
  Bottom 0.406: DRIVER4.P$7 72.39,6.35 61.59,6.35 48.9,19.05 40.64,19.05 v27.3,32.38
STEP2  (via drill 0.3)
  Top 0.406: v57.79,22.22 55.88,20.32 v53.98,20.32 | ATMEGA32.13 27.3,34.66 27.3,33.66 v27.94,33.02
  Bottom 0.406: v57.79,22.22 73.02,22.22 DRIVER3.P$7 | v27.94,33.02 40.64,20.32 v53.98,20.32
STEP3  (via drill 0.3)
  Top 0.406: v57.79,38.73 50.8,31.75 v40.01,31.75 | ATMEGA32.14 27.94,35.17 27.94,34.29 v28.58,33.66
  Bottom 0.406: DRIVER2.P$7 73.02,38.73 v57.79,38.73 | v40.01,31.75 30.48,31.75 v28.58,33.66
STEP4  (via drill 0.3)
  Top 0.406: v58.42,54.61 55.88,52.07 55.88,38.73 50.16,33.02 v41.27,33.02 | ATMEGA32.15 28.58,35.65 28.58,34.92 v29.21,34.29
  Bottom 0.406: DRIVER1.P$7 73.66,54.61 v58.42,54.61 | v41.27,33.02 30.48,33.02 v29.21,34.29
TX5V
  Top 0.305: ATMEGA32.10 23.05,35.26 22.16,34.36 LOGIC_DIODE.C | LOGIC_DIODE.C
V_BAT
  Bottom 2: -+BATTERY.2 24.08,63.55 3A-F-FUSE.1
VMOT
  Bottom 0.305: DRIVER4.P$9 59.05,16.51
  Bottom 0.406: 56.64,31.91 57.04,32.31 57.04,33.02 57.04,33.71 56.64,34.11 | 55.88,48.31 56.64,48.31 57.24,48.91 | 55.88,50.71 56.64,50.71 57.24,50.11 | 55.59,64.43 56.27,65.11 56.64,65.11 | 58.13,65.75 58.76,65.11 59.04,65.11
  Bottom 1.016: 55.88,23.41 53.61,23.41 52.17,24.84 48.03,24.84 3.3V_PO_REG.2
  Bottom 1.27: 3A-F-FUSE.2 46.99,62.86 46.35,62.23 5V_PO_REG.2
  Bottom 1.5: C_DRV1.1 59.69,63.48 DRIVER1.P$9 58.83,66.04 arc45 58.13,65.75 56.26,63.88 arc-45 55.88,63.72 | C_DRV2.1 59.69,46.97 DRIVER2.P$9 55.88,49.53 | C_DRV3.1 59.69,30.46 DRIVER3.P$9 57.04,33.02 55.88,33.02 | C_DRV4.1 59.69,13.95 DRIVER4.P$9 | 3A-F-FUSE.2 46.65,63.16
  Bottom 2: 3A-F-FUSE.2 49.24,65.75 arc-45 49.94,66.04 53.98,66.04 55.59,64.43 arc-45 55.88,63.72 55.88,50.71 55.88,49.53 55.88,48.31 55.88,33.02 55.88,23.41 55.88,19.68 59.05,16.51

### Text on the board
tPlace: Vmot | gnd 5V A0 A1 A2 A3 A4 A5 A6 A7 | 1B / / 1A / / 2A / / 2B | sck mi mo B4 EN B2 B1 B0 | sck mi mo B4 EN B2 B1 B0 | scl sda C2 C3 C4 C5 C6 C7 | Vmot | gnd | Vout | 1B / / 1A / / 2A / / 2B | Vmot | UART< >I2C | 1B / / 1A / / 2A / / 2B | Vout | Vmot | Not A Kiwi - Rev 3.1S / By Augustin.B (07/18) | /home/yyunko/Desktop/kiwi.bmp | Gnd | 1B / / 1A / / 2A / / 2B | Gn G2 G0 G3 | 3.3 rst en G1 | ms1 ms2 ms3